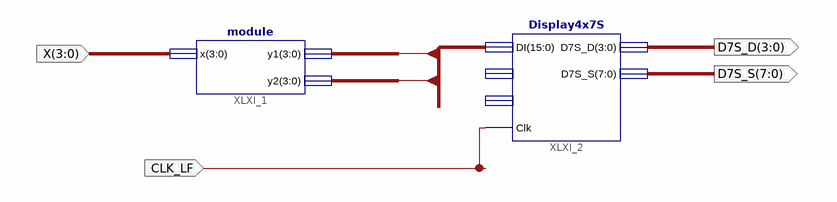
[diagram p0: schematic sheet 1]
// Xilinx ISE schematic schematic_module.sch (xc9500xl) as structural Verilog: 2 symbols, 4 ports
module schematic_module (
  input  CLK_LF,
  input  [3:0] X,
  output [3:0] D7S_D,
  output [7:0] D7S_S
);

  wire [15:0] DI;

  \module  XLXI_1 (.x(X), .y1(DI[3:0]), .y2(DI[15:12]));
  Display4x7S XLXI_2 (.DI(DI), .D7S_D(D7S_D), .D7S_S(D7S_S), .Clk(CLK_LF));  // open: DP, Blank
endmodule
